# Altium schematic sheet USB_ISOLATE.SchDoc
size A; SheetNumber: 9; SheetTotal: 10
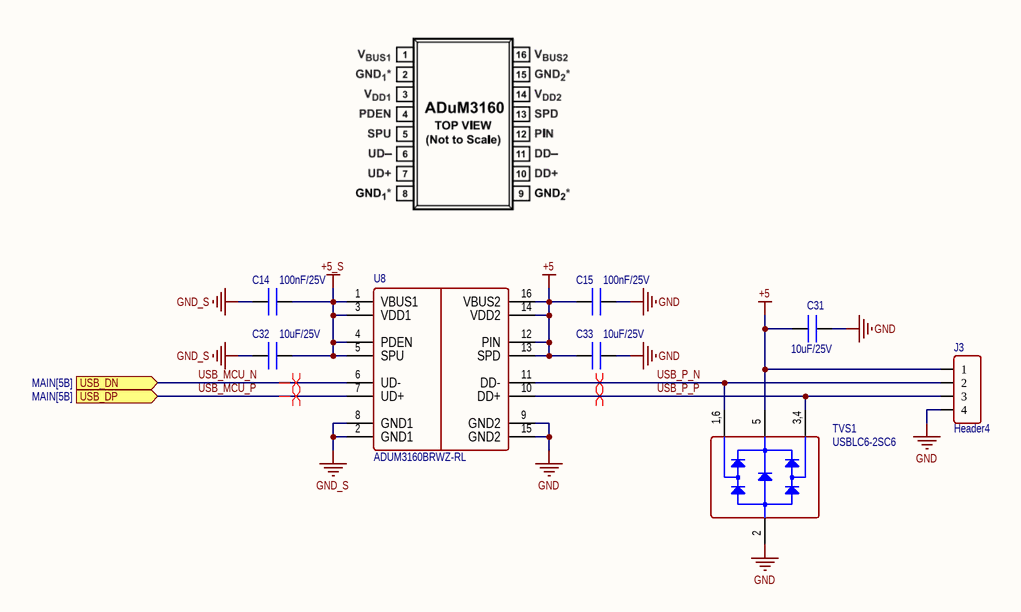
[diagram p0: USB_ISOLATE.SchDoc]

## Parts
C14  100nF/25V  [CN-SMD-0603]
C15  100nF/25V  [CN-SMD-0603]
C31  10uF/25V  [CN-SMD-0603]
C32  10uF/25V  [CN-SMD-0603]
C33  10uF/25V  [CN-SMD-0603]
J3  Header4  [XH2.54-4-DIP]
TVS1  USBLC6-2SC6  [SOT23-6]
U8  ADUM3160BRWZ-RL  [SO16L]

## Ports
USB_DN (in, see MAIN[5B]), USB_DP (in, see MAIN[5B])

## Nets
+5: C15.2 C31.2 C33.2 J3.1 TVS1.5 U8.12(PIN) U8.13(SPD) U8.14(VDD2) U8.16(VBUS2)
+5_S: C14.1 C32.1 U8.1(VBUS1) U8.3(VDD1) U8.4(PDEN) U8.5(SPU)
GND: C15.1 C31.1 C33.1 J3.4 TVS1.2 U8.9(GND2) U8.15(GND2)
GND_S: C14.2 C32.2 U8.2(GND1) U8.8(GND1)
USB_MCU_N: U8.6(UD-) ; port USB_DN
USB_MCU_P: U8.7(UD+) ; port USB_DP
USB_P_N: J3.2 TVS1.1,6(IO1) U8.11(DD-)
USB_P_P: J3.3 TVS1.3,4(IO2) U8.10(DD+)

## Layout directives
differential pair; differential pair class USB: USB_P_N, USB_P_P
differential pair: USB_MCU_N, USB_MCU_P

## Library data of the parts
C14 C15 = CN: CL10B104KA8NNNC; PN: CL10B104KA8NNNC
C31-C33 = CN: 0603W106M250XD; PN: 0603W106M250XD
J3 = Header4: Connector 4; Manufacturer: W¨¹rth Elektronik eiSos GmbH; partNo: 613002143121; ComponentLink1 Description: Manufacturer; ComponentLink2 Description: Datasheet; NoPins: 02; Created Date: 29 March 2013; ComponentLink1URL: http://www.we-online.com; ComponentLink2URL: http://katalog.we-online.de/em/datasheet/6130xx143121.pdf; Created by: Karrer Zheng
TVS1 = USBLC6-2: PN: USBLC6-2SC6
U8 = ADUM3160: Full/Low Speed 2.5 kV USB Digital Isolator; PN: ADUM3160BRWZ-RL